# EasyEDA Pro project design.epro, board board_top_pcb
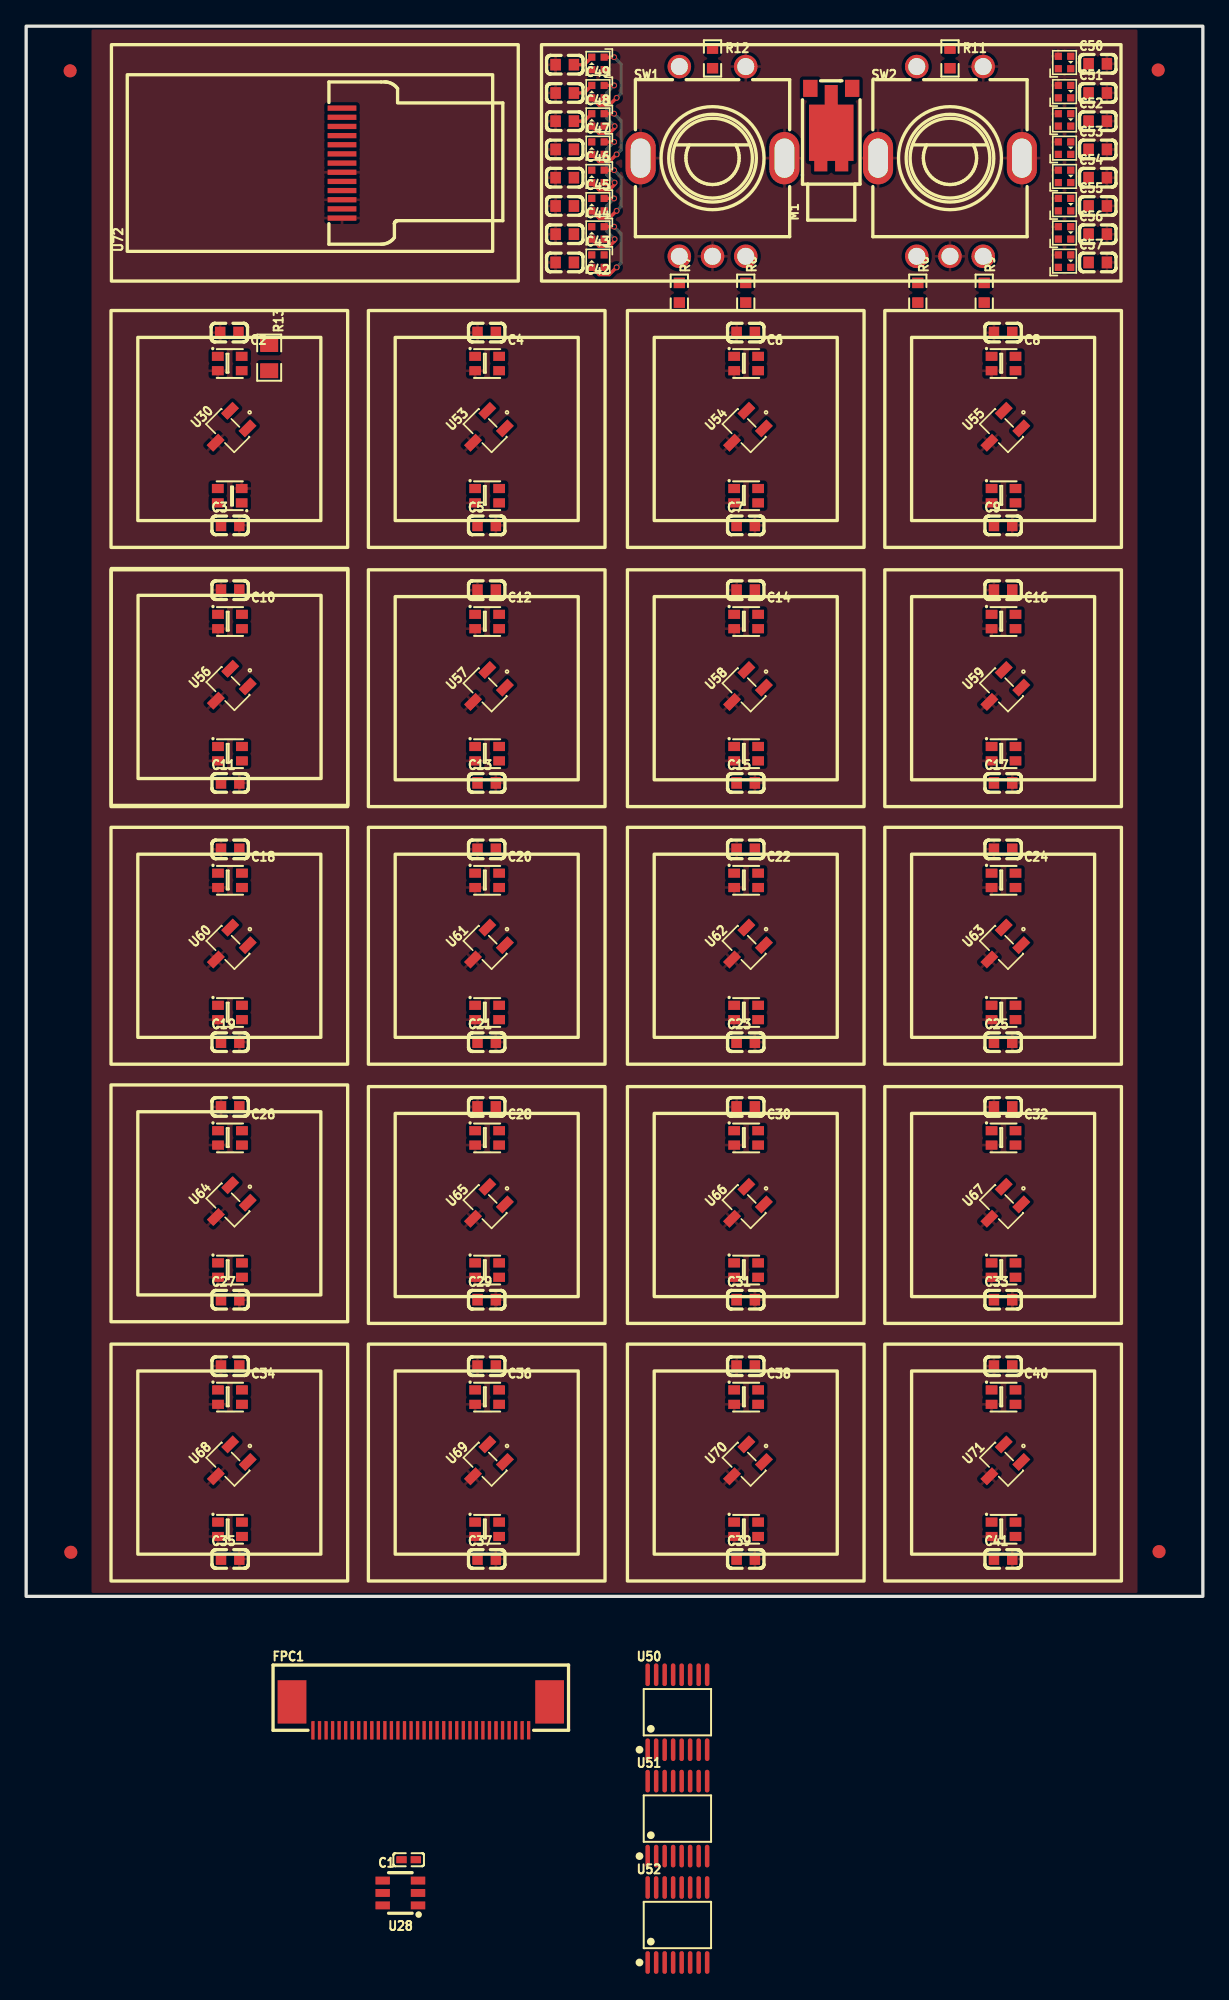
[diagram p13: board, top side]
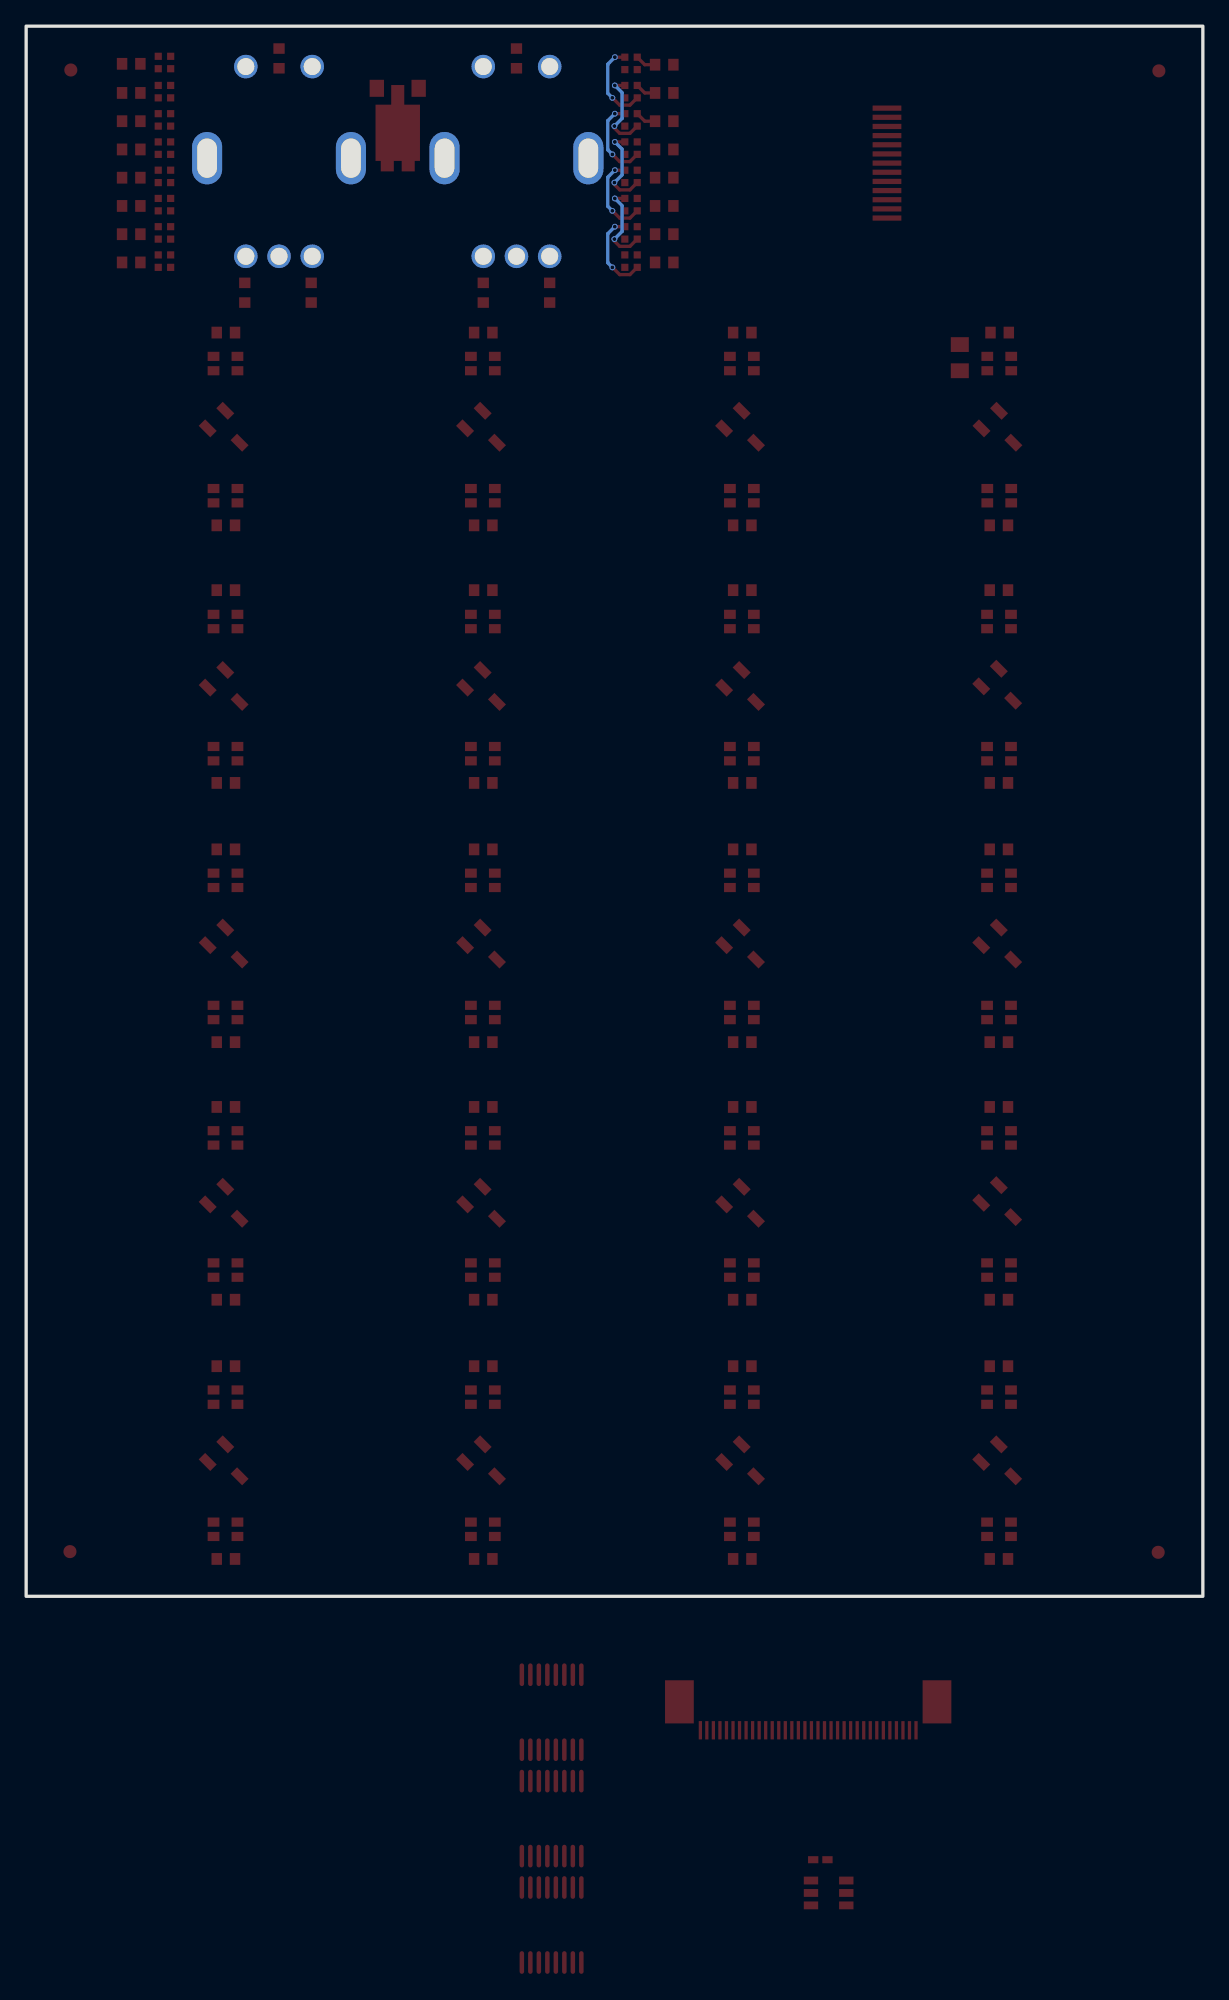
[diagram p14: board, bottom side, seen from below]

Outline 90 x 120 mm; copper layers: Top Layer, Bottom Layer. Coordinates in mm from the lower left corner of the outline.
Outline path: rectangle 0,120 90,0
Stack: Top Layer 0.035mm / Dielectric1 1.51mm FR4 er 4.5 / Bottom Layer 0.035mm

## Design rules (mm)
template: Custom Config
spacing copperThickness1oz (default): track to track 0.102, other pairs 0.152 to 0.3
spacing copperThickness2oz: track to track 0.203, other pairs 0.152 to 0.3
track width copperThickness1oz (default): min 0.127, default 0.254, max 2.54
track width copperThickness2oz: min 0.203, default 0.254, max 2.54
differential pair differentialPair (default): width min 0.127, default 0.254, max 2.54; gap min 0.152, default 0.152
via viaSize (default): diameter min 0.45, default 0.45, max 10; hole min 0.3, default 0.3, max 6.3

## Placement (name value [footprint] x y rotation side)
C1  1uF  [C0402]  29.26 -20.13 180 top
C2  100nF  [C0603]  15.54 96.58 180 top
C3  100nF  [C0603]  15.6 81.85 0 top
C4  100nF  [C0603]  35.23 96.58 180 top
C5  100nF  [C0603]  35.23 81.85 0 top
C6  100nF  [C0603]  55.04 96.58 180 top
C7  100nF  [C0603]  55.04 81.85 0 top
C8  100nF  [C0603]  74.72 96.58 180 top
C9  100nF  [C0603]  74.72 81.85 0 top
C10  100nF  [C0603]  15.6 76.9 180 top
C11  100nF  [C0603]  15.6 62.16 0 top
C12  100nF  [C0603]  35.23 76.9 180 top
C13  100nF  [C0603]  35.23 62.16 0 top
C14  100nF  [C0603]  55.04 76.9 180 top
C15  100nF  [C0603]  55.04 62.16 0 top
C16  100nF  [C0603]  74.72 76.9 180 top
C17  100nF  [C0603]  74.72 62.16 0 top
C18  100nF  [C0603]  15.6 57.08 180 top
C19  100nF  [C0603]  15.6 42.35 0 top
C20  100nF  [C0603]  35.23 57.08 180 top
C21  100nF  [C0603]  35.23 42.35 0 top
C22  100nF  [C0603]  55.04 57.08 180 top
C23  100nF  [C0603]  55.04 42.35 0 top
C24  100nF  [C0603]  74.72 57.08 180 top
C25  100nF  [C0603]  74.72 42.35 0 top
C26  100nF  [C0603]  15.6 37.4 180 top
C27  100nF  [C0603]  15.6 22.67 0 top
C28  100nF  [C0603]  35.23 37.4 180 top
C29  100nF  [C0603]  35.23 22.67 0 top
C30  100nF  [C0603]  55.04 37.4 180 top
C31  100nF  [C0603]  55.04 22.67 0 top
C32  100nF  [C0603]  74.72 37.4 180 top
C33  100nF  [C0603]  74.72 22.67 0 top
C34  100nF  [C0603]  15.6 17.59 180 top
C35  100nF  [C0603]  15.6 2.85 0 top
C36  100nF  [C0603]  35.23 17.59 180 top
C37  100nF  [C0603]  35.23 2.85 0 top
C38  100nF  [C0603]  55.04 17.59 180 top
C39  100nF  [C0603]  55.04 2.85 0 top
C40  100nF  [C0603]  74.72 17.59 180 top
C41  100nF  [C0603]  74.72 2.85 0 top
C42  100nF  [C0603]  41.19 101.94 180 top
C43  100nF  [C0603]  41.19 104.1 180 top
C44  100nF  [C0603]  41.19 106.26 180 top
C45  100nF  [C0603]  41.19 108.42 180 top
C46  100nF  [C0603]  41.19 110.58 180 top
C47  100nF  [C0603]  41.19 112.74 180 top
C48  100nF  [C0603]  41.19 114.9 180 top
C49  100nF  [C0603]  41.19 117.06 180 top
C50  100nF  [C0603]  81.96 117.12 0 top
C51  100nF  [C0603]  81.96 114.9 0 top
C52  100nF  [C0603]  81.96 112.74 0 top
C53  100nF  [C0603]  81.96 110.58 0 top
C54  100nF  [C0603]  81.96 108.42 0 top
C55  100nF  [C0603]  81.96 106.26 0 top
C56  100nF  [C0603]  81.96 104.1 0 top
C57  100nF  [C0603]  81.96 101.94 0 top
FPC1  AFC07-S34FCC-00  [FPC-SMD_P0.50-34P_LCSXJ-H2.0]  30.19 -9.15 0 top
LED41  WS2812B-2020  [LED-SMD_4P-L2.0-W2.0-TL_WS2812B-2020]  15.57 94.22 0 top
LED42  WS2812B-2020  [LED-SMD_4P-L2.0-W2.0-TL_WS2812B-2020]  15.57 84.11 180 top
LED43  WS2812B-2020  [LED-SMD_4P-L2.0-W2.0-TL_WS2812B-2020]  35.26 94.22 0 top
LED44  WS2812B-2020  [LED-SMD_4P-L2.0-W2.0-TL_WS2812B-2020]  35.26 84.11 0 top
LED45  WS2812B-2020  [LED-SMD_4P-L2.0-W2.0-TL_WS2812B-2020]  55.07 94.22 0 top
LED46  WS2812B-2020  [LED-SMD_4P-L2.0-W2.0-TL_WS2812B-2020]  55.07 84.11 0 top
LED47  WS2812B-2020  [LED-SMD_4P-L2.0-W2.0-TL_WS2812B-2020]  74.75 94.22 0 top
LED48  WS2812B-2020  [LED-SMD_4P-L2.0-W2.0-TL_WS2812B-2020]  74.75 84.11 0 top
LED49  WS2812B-2020  [LED-SMD_4P-L2.0-W2.0-TL_WS2812B-2020]  15.59 74.5 0 top
LED50  WS2812B-2020  [LED-SMD_4P-L2.0-W2.0-TL_WS2812B-2020]  15.59 64.4 0 top
LED51  WS2812B-2020  [LED-SMD_4P-L2.0-W2.0-TL_WS2812B-2020]  35.26 74.5 0 top
LED52  WS2812B-2020  [LED-SMD_4P-L2.0-W2.0-TL_WS2812B-2020]  35.26 64.4 0 top
LED53  WS2812B-2020  [LED-SMD_4P-L2.0-W2.0-TL_WS2812B-2020]  55.07 74.5 0 top
LED54  WS2812B-2020  [LED-SMD_4P-L2.0-W2.0-TL_WS2812B-2020]  55.07 64.4 0 top
LED55  WS2812B-2020  [LED-SMD_4P-L2.0-W2.0-TL_WS2812B-2020]  74.75 74.5 0 top
LED56  WS2812B-2020  [LED-SMD_4P-L2.0-W2.0-TL_WS2812B-2020]  74.75 64.4 0 top
LED57  WS2812B-2020  [LED-SMD_4P-L2.0-W2.0-TL_WS2812B-2020]  15.59 54.72 0 top
LED58  WS2812B-2020  [LED-SMD_4P-L2.0-W2.0-TL_WS2812B-2020]  15.59 44.62 0 top
LED59  WS2812B-2020  [LED-SMD_4P-L2.0-W2.0-TL_WS2812B-2020]  35.26 54.72 0 top
LED60  WS2812B-2020  [LED-SMD_4P-L2.0-W2.0-TL_WS2812B-2020]  35.26 44.62 0 top
LED61  WS2812B-2020  [LED-SMD_4P-L2.0-W2.0-TL_WS2812B-2020]  55.07 54.72 0 top
LED62  WS2812B-2020  [LED-SMD_4P-L2.0-W2.0-TL_WS2812B-2020]  55.07 44.62 0 top
LED63  WS2812B-2020  [LED-SMD_4P-L2.0-W2.0-TL_WS2812B-2020]  74.75 54.72 0 top
LED64  WS2812B-2020  [LED-SMD_4P-L2.0-W2.0-TL_WS2812B-2020]  74.75 44.62 0 top
LED65  WS2812B-2020  [LED-SMD_4P-L2.0-W2.0-TL_WS2812B-2020]  15.59 35.03 0 top
LED66  WS2812B-2020  [LED-SMD_4P-L2.0-W2.0-TL_WS2812B-2020]  15.59 24.93 0 top
LED67  WS2812B-2020  [LED-SMD_4P-L2.0-W2.0-TL_WS2812B-2020]  35.26 35.03 0 top
LED68  WS2812B-2020  [LED-SMD_4P-L2.0-W2.0-TL_WS2812B-2020]  35.26 24.93 0 top
LED69  WS2812B-2020  [LED-SMD_4P-L2.0-W2.0-TL_WS2812B-2020]  55.07 35.03 0 top
LED70  WS2812B-2020  [LED-SMD_4P-L2.0-W2.0-TL_WS2812B-2020]  55.07 24.93 0 top
LED71  WS2812B-2020  [LED-SMD_4P-L2.0-W2.0-TL_WS2812B-2020]  74.75 35.03 0 top
LED72  WS2812B-2020  [LED-SMD_4P-L2.0-W2.0-TL_WS2812B-2020]  74.75 24.93 0 top
LED73  WS2812B-2020  [LED-SMD_4P-L2.0-W2.0-TL_WS2812B-2020]  15.59 15.22 0 top
LED74  WS2812B-2020  [LED-SMD_4P-L2.0-W2.0-TL_WS2812B-2020]  15.59 5.12 0 top
LED75  WS2812B-2020  [LED-SMD_4P-L2.0-W2.0-TL_WS2812B-2020]  35.26 15.22 0 top
LED76  WS2812B-2020  [LED-SMD_4P-L2.0-W2.0-TL_WS2812B-2020]  35.26 5.12 0 top
LED77  WS2812B-2020  [LED-SMD_4P-L2.0-W2.0-TL_WS2812B-2020]  55.07 15.22 0 top
LED78  WS2812B-2020  [LED-SMD_4P-L2.0-W2.0-TL_WS2812B-2020]  55.07 5.12 0 top
LED79  WS2812B-2020  [LED-SMD_4P-L2.0-W2.0-TL_WS2812B-2020]  74.75 15.22 0 top
LED80  WS2812B-2020  [LED-SMD_4P-L2.0-W2.0-TL_WS2812B-2020]  74.75 5.12 0 top
LED81  SK6805-EC15  [LED-SMD_4P-L1.5-W1.5-BL]  43.74 102.04 180 top
LED82  SK6805-EC15  [LED-SMD_4P-L1.5-W1.5-BL]  43.74 104.2 180 top
LED83  SK6805-EC15  [LED-SMD_4P-L1.5-W1.5-BL]  43.74 106.36 180 top
LED84  SK6805-EC15  [LED-SMD_4P-L1.5-W1.5-BL]  43.74 108.52 180 top
LED85  SK6805-EC15  [LED-SMD_4P-L1.5-W1.5-BL]  43.74 110.68 180 top
LED86  SK6805-EC15  [LED-SMD_4P-L1.5-W1.5-BL]  43.74 112.84 180 top
LED87  SK6805-EC15  [LED-SMD_4P-L1.5-W1.5-BL]  43.74 115 180 top
LED88  SK6805-EC15  [LED-SMD_4P-L1.5-W1.5-BL]  43.74 117.16 180 top
LED89  SK6805-EC15  [LED-SMD_4P-L1.5-W1.5-BL]  79.42 117.22 0 top
LED90  SK6805-EC15  [LED-SMD_4P-L1.5-W1.5-BL]  79.42 115 0 top
LED91  SK6805-EC15  [LED-SMD_4P-L1.5-W1.5-BL]  79.42 112.84 0 top
LED92  SK6805-EC15  [LED-SMD_4P-L1.5-W1.5-BL]  79.42 110.68 0 top
LED93  SK6805-EC15  [LED-SMD_4P-L1.5-W1.5-BL]  79.42 108.52 0 top
LED94  SK6805-EC15  [LED-SMD_4P-L1.5-W1.5-BL]  79.42 106.36 0 top
LED95  SK6805-EC15  [LED-SMD_4P-L1.5-W1.5-BL]  79.42 104.2 0 top
LED96  SK6805-EC15  [LED-SMD_4P-L1.5-W1.5-BL]  79.42 102.04 0 top
M1  Z3OC1T8219731  [VIBRATING-MOTOR-SMD_3P-C9900001680]  61.58 113.73 90 top
R6  1kΩ  [R0603]  68.2 99.63 270 top
R7  1kΩ  [R0603]  49.96 99.63 270 top
R8  1kΩ  [R0603]  55.04 99.63 270 top
R9  1kΩ  [R0603]  73.28 99.63 270 top
R11  1kΩ  [R0603]  70.66 117.54 270 top
R12  1kΩ  [R0603]  52.5 117.54 270 top
R13  500Ω  [R0805]  18.59 94.66 270 top
SW1  EC11E15244G1  [SW-TH_EC11E15244G1]  52.5 109.66 0 top
SW2  EC11E15244G1  [SW-TH_EC11E15244G1]  70.66 109.66 0 top
U28  LTC1983ES6-5#TRMPBF  [SOT-23-6_L2.9-W1.6-P0.95-LS2.8-BR]  28.62 -22.67 0 top
U30  HAL49ESO  [SOT-23-3_L2.9-W1.6-P1.90-LS2.8-BR-CW]  15.38 89.05 45 top
U50  74HC4051PW,118  [TSSOP-16_L5.0-W4.4-P0.65-LS6.4-BL]  49.81 -8.86 0 top
U51  74HC4051PW,118  [TSSOP-16_L5.0-W4.4-P0.65-LS6.4-BL]  49.81 -16.99 0 top
U52  74HC4051PW,118  [TSSOP-16_L5.0-W4.4-P0.65-LS6.4-BL]  49.81 -25.12 0 top
U53  HAL49ESO  [SOT-23-3_L2.9-W1.6-P1.90-LS2.8-BR-CW]  35.06 89.05 45 top
U54  HAL49ESO  [SOT-23-3_L2.9-W1.6-P1.90-LS2.8-BR-CW]  54.87 89.05 45 top
U55  HAL49ESO  [SOT-23-3_L2.9-W1.6-P1.90-LS2.8-BR-CW]  74.56 89.05 45 top
U56  HAL49ESO  [SOT-23-3_L2.9-W1.6-P1.90-LS2.8-BR-CW]  15.39 69.33 45 top
U57  HAL49ESO  [SOT-23-3_L2.9-W1.6-P1.90-LS2.8-BR-CW]  35.06 69.24 45 top
U58  HAL49ESO  [SOT-23-3_L2.9-W1.6-P1.90-LS2.8-BR-CW]  54.87 69.24 45 top
U59  HAL49ESO  [SOT-23-3_L2.9-W1.6-P1.90-LS2.8-BR-CW]  74.56 69.24 45 top
U60  HAL49ESO  [SOT-23-3_L2.9-W1.6-P1.90-LS2.8-BR-CW]  15.39 49.55 45 top
U61  HAL49ESO  [SOT-23-3_L2.9-W1.6-P1.90-LS2.8-BR-CW]  35.06 49.55 45 top
U62  HAL49ESO  [SOT-23-3_L2.9-W1.6-P1.90-LS2.8-BR-CW]  54.87 49.55 45 top
U63  HAL49ESO  [SOT-23-3_L2.9-W1.6-P1.90-LS2.8-BR-CW]  74.56 49.55 45 top
U64  HAL49ESO  [SOT-23-3_L2.9-W1.6-P1.90-LS2.8-BR-CW]  15.39 29.87 45 top
U65  HAL49ESO  [SOT-23-3_L2.9-W1.6-P1.90-LS2.8-BR-CW]  35.06 29.74 45 top
U66  HAL49ESO  [SOT-23-3_L2.9-W1.6-P1.90-LS2.8-BR-CW]  54.87 29.74 45 top
U67  HAL49ESO  [SOT-23-3_L2.9-W1.6-P1.90-LS2.8-BR-CW]  74.56 29.74 45 top
U68  HAL49ESO  [SOT-23-3_L2.9-W1.6-P1.90-LS2.8-BR-CW]  15.39 10.06 45 top
U69  HAL49ESO  [SOT-23-3_L2.9-W1.6-P1.90-LS2.8-BR-CW]  35.06 10.06 45 top
U70  HAL49ESO  [SOT-23-3_L2.9-W1.6-P1.90-LS2.8-BR-CW]  54.87 10.06 45 top
U71  HAL49ESO  [SOT-23-3_L2.9-W1.6-P1.90-LS2.8-BR-CW]  74.56 10.06 45 top
U72  N096-1608TBBIG11-H13  [OLED-SMD_ST7735S]  24.16 109.53 90 top
U73  FIDUCIAL  [FIDUCIAL_1MM]  3.36 116.58 0 top
U74  FIDUCIAL  [FIDUCIAL_1MM]  86.58 116.65 0 top
U75  FIDUCIAL  [FIDUCIAL_1MM]  3.42 3.36 0 top
U76  FIDUCIAL  [FIDUCIAL_1MM]  86.65 3.42 0 top

## Footprints (pads in the part's own frame, mm; a bottom-side part is the same pattern mirrored in y, then rotated)
C0402
  rect 0.79x0.54 smd: 1(-0.545,0) 2(0.545,0)
C0603
  rect 0.8x0.9 smd: 1(-0.7,0) 2(0.7,0)
FIDUCIAL_1MM
  round 1 smd: 1(0,0)
FPC-SMD_P0.50-34P_LCSXJ-H2.0
  rect 0.25x1.4 smd: 1(-8.247,-1.087) 2(-7.747,-1.087) 3(-7.247,-1.087) 4(-6.747,-1.087) 5(-6.247,-1.087) 6(-5.747,-1.087) 7(-5.247,-1.087) 8(-4.747,-1.087) 9(-4.247,-1.087) 10(-3.747,-1.087) 11(-3.247,-1.087) 12(-2.747,-1.087) 13(-2.247,-1.087) 14(-1.747,-1.087) 15(-1.247,-1.087) 16(-0.747,-1.087) 17(-0.247,-1.087) 18(0.251,-1.085) 19(0.751,-1.085) 20(1.251,-1.085) 21(1.751,-1.085) 22(2.251,-1.085) 23(2.751,-1.085) 24(3.251,-1.085) 25(3.751,-1.085) 26(4.251,-1.085) 27(4.751,-1.085) 28(5.251,-1.085) 29(5.751,-1.085) 30(6.251,-1.085) 31(6.751,-1.085) 32(7.253,-1.087) 33(7.753,-1.087) 34(8.248,-1.083)
  rect 2.2x3.3 smd: 35(-9.85,1.087) 36(9.85,1.087)
LED-SMD_4P-L1.5-W1.5-BL
  rect 0.55x0.55 smd: 1(-0.475,-0.475) 2(0.475,-0.475) 3(0.475,0.475) 4(-0.475,0.475)
LED-SMD_4P-L2.0-W2.0-TL_WS2812B-2020
  rect 0.9x0.7 smd: 1(-0.915,0.55) 2(-0.915,-0.55) 3(0.915,-0.55) 4(0.915,0.55)
OLED-SMD_ST7735S
  rect 0.4x2.2 smd: 1(4.2,0) 2(3.5,0) 3(2.8,0) 4(2.1,0) 5(1.4,0) 6(0.7,0) 7(0,0) 8(-0.7,0) 9(-1.4,0) 10(-2.1,0) 11(-2.8,0) 12(-3.5,0) 13(-4.2,0)
R0603
  rect 0.806x0.864 smd: 1(-0.753,0) 2(0.753,0)
R0805
  rect 1.133x1.377 smd: 1(-1,0) 2(1,0)
SOT-23-3_L2.9-W1.6-P1.90-LS2.8-BR-CW
  rect 1.25x0.7 smd: 1(1.249,-0.95) 2(-1.25,0) 3(1.249,0.95)
SOT-23-6_L2.9-W1.6-P0.95-LS2.8-BR
  rect 1.1x0.6 smd: 1(1.35,-0.95) 2(1.35,0) 3(1.35,0.95) 4(-1.35,0.95) 5(-1.35,0) 6(-1.35,-0.95)
SW-TH_EC11E15244G1
  oval 2.3x4 hole 1.5x3: 6(5.5,0.25) 7(-5.5,0.25)
  round 1.8 hole 1.3: A(-2.54,-7.25) B(2.54,-7.25) C(0,-7.25) D(-2.54,7.25) E(2.54,7.25)
TSSOP-16_L5.0-W4.4-P0.65-LS6.4-BL
  oval 0.343x1.732 smd: 1(-2.275,-2.866) 2(-1.625,-2.866) 3(-0.975,-2.866) 4(-0.325,-2.866) 5(0.325,-2.866) 6(0.975,-2.866) 7(1.625,-2.866) 8(2.275,-2.866) 9(2.275,2.866) 10(1.625,2.866) 11(0.975,2.866) 12(0.325,2.866) 13(-0.325,2.866) 14(-0.975,2.866) 15(-1.625,2.866) 16(-2.275,2.866)
VIBRATING-MOTOR-SMD_3P-C9900001680
  rect 1.3x1.1 smd: 1(1.525,1.6) 2(1.525,-1.6)
  custom 6.6x3.4 smd: 3(-1.525,0)

## Nets
As in the schematic.

Pads without a net: LED96 3; M1 1 2 3; U52 1 2 4 5; U72 1 2 3 4 5 9; U73 1; U74 1; U75 1; U76 1

## Via types
v1: diameter 0.45, hole 0.3, Top Layer to Bottom Layer, 14 vias

## Routing (per net, layer and track width the routed paths; a pad name or vN(x,y) marks a point on that pad's centre or on a via; arc(x,y) is an arc through that point)
+5V: length 4.8
  Top Layer w0.254: 41.9,117.06 42.69,117.06 LED88.2 ; 41.9,112.74 42.69,112.74 LED86.2 ; LED87.2 42.69,114.9 41.9,114.9
$4N64211: length 6.6
  Top Layer w0.254: 43.26,101.57 43.27,101.57 43.82,101.01 44.6,101.01 45.15,101.57 v1(45.16,101.57) ; v1(44.97,104.68) LED82.1
  Bottom Layer w0.254: v1(44.97,104.68) 45.51,104.13 45.51,101.91 v1(45.16,101.57)
$4N65487: length 6.6
  Top Layer w0.254: LED83.1 v1(44.97,106.84) ; LED82.3 43.27,103.73 43.82,103.17 44.6,103.17 45.01,103.58 v1(45.01,103.73)
  Bottom Layer w0.254: v1(45.01,103.73) 44.42,104.31 44.42,106.29 v1(44.97,106.84)
$4N65864: length 6.6
  Top Layer w0.254: v1(45.16,105.88) 45.15,105.88 44.6,105.33 43.82,105.33 43.27,105.88 43.26,105.88 ; v1(44.97,108.99) LED84.1
  Bottom Layer w0.254: v1(44.97,108.99) 45.51,108.45 45.51,106.23 v1(45.16,105.88)
$4N66245: length 6.6
  Top Layer w0.254: LED84.3 43.27,108.04 43.82,107.49 44.6,107.49 45.01,107.9 v1(45.01,108.04) ; LED85.1 v1(44.97,111.15)
  Bottom Layer w0.254: v1(45.01,108.04) 44.42,108.63 44.42,110.6 v1(44.97,111.15)
$4N66630: length 6.6
  Top Layer w0.254: v1(45.16,110.2) 45.15,110.2 44.6,109.65 43.82,109.65 43.27,110.2 LED85.3 ; v1(44.97,113.31) LED86.1
  Bottom Layer w0.254: v1(45.16,110.2) 45.51,110.55 45.51,112.77 v1(44.97,113.31)
$4N67019: length 6.6
  Top Layer w0.254: LED87.1 v1(44.97,115.47) ; LED86.3 43.27,112.36 43.82,111.81 44.6,111.81 45.01,112.22 v1(45.01,112.36)
  Bottom Layer w0.254: v1(45.01,112.36) 44.42,112.95 44.42,114.92 v1(44.97,115.47)
$4N67412: length 6.6
  Top Layer w0.254: v1(45.16,114.52) 45.15,114.52 44.6,113.97 43.82,113.97 43.27,114.52 43.26,114.52 ; v1(44.97,117.63) LED88.1
  Bottom Layer w0.254: v1(45.16,114.52) 45.51,114.87 45.51,117.09 v1(44.97,117.63)

## Copper pours and planes (outline as drawn; the poured copper is in the pictures)
GND on Top Layer: 5,120 85,120 85,0 5,0
